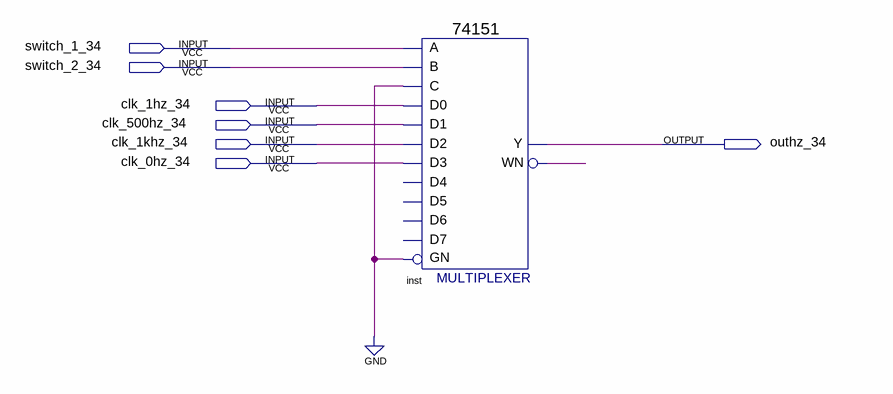
[diagram p0: schematic sheet]
// Quartus schematic spead_select.bdf as structural Verilog: 1 symbols, 7 pins
module spead_select (
  input  switch_1_34,
  input  switch_2_34,
  input  clk_1hz_34,
  input  clk_500hz_34,
  input  clk_1khz_34,
  input  clk_0hz_34,
  output outhz_34
);

  wire inst_wn;

  \74151  inst (
    .GN(1'b0), .C(1'b0), .B(switch_2_34), .A(switch_1_34), .D0(clk_1hz_34), .D1(clk_500hz_34),
    .D3(clk_0hz_34), .D2(clk_1khz_34), .Y(outhz_34), .WN(inst_wn));  // open: D5, D4, D6, D7
endmodule
